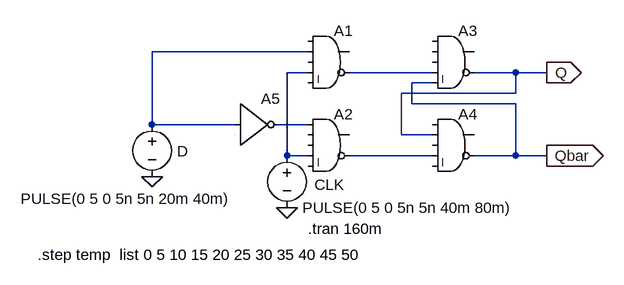
[diagram p0: schematic DFF.asc]
DFF.asc, the LTspice schematic file:
Version 4
SHEET 1 880 680
WIRE 112 80 -128 80
WIRE 112 112 80 112
WIRE 304 112 176 112
WIRE 432 112 368 112
WIRE 480 112 432 112
WIRE 304 128 272 128
WIRE 432 144 432 112
WIRE 432 144 256 144
WIRE 272 160 272 128
WIRE 432 160 272 160
WIRE -128 192 -128 80
WIRE 0 192 -128 192
WIRE 112 192 64 192
WIRE 256 208 256 144
WIRE 304 208 256 208
WIRE 80 240 80 112
WIRE 112 240 80 240
WIRE 304 240 176 240
WIRE 432 240 432 160
WIRE 432 240 368 240
WIRE 480 240 432 240
FLAG -128 272 0
FLAG 80 320 0
FLAG 480 112 Q
IOPIN 480 112 Out
FLAG 480 240 Qbar
IOPIN 480 240 Out
SYMBOL Digital\\and 144 32 R0
SYMATTR InstName A1
SYMBOL Digital\\and 144 160 R0
SYMATTR InstName A2
SYMBOL Digital\\and 336 32 R0
SYMATTR InstName A3
SYMBOL Digital\\and 336 160 R0
SYMATTR InstName A4
SYMBOL Digital\\inv 0 128 R0
SYMATTR InstName A5
SYMBOL voltage -128 176 R0
WINDOW 0 39 57 Left 2
WINDOW 3 -202 130 Left 2
WINDOW 123 0 0 Left 0
SYMATTR InstName D
SYMATTR Value PULSE(0 5 0 5n 5n 20m 40m)
SYMBOL voltage 80 224 R0
WINDOW 0 42 61 Left 2
WINDOW 123 0 0 Left 0
WINDOW 39 0 0 Left 0
SYMATTR InstName CLK
SYMATTR Value PULSE(0 5 0 5n 5n 40m 80m)
TEXT 112 352 Left 2 !.tran 160m
TEXT -304 392 Left 2 !.step temp  list 0 5 10 15 20 25 30 35 40 45 50

The netlist it stands for:
* DFF.asc
A1 0 N001 0 N002 0 N003 0 0 AND
A2 N004 0 0 N002 0 N005 0 0 AND
A3 0 0 0 N003 Qbar Q 0 0 AND
A4 0 Q 0 N005 0 Qbar 0 0 AND
A5 N001 0 0 0 0 N004 0 0 BUF
V§D N001 0 PULSE(0 5 0 5n 5n 20m 40m)
V§CLK N002 0 PULSE(0 5 0 5n 5n 40m 80m)
.tran 160m
.step temp  list 0 5 10 15 20 25 30 35 40 45 50
.backanno
.end

* Results of the author's LTspice run, read from the files saved beside the schematic
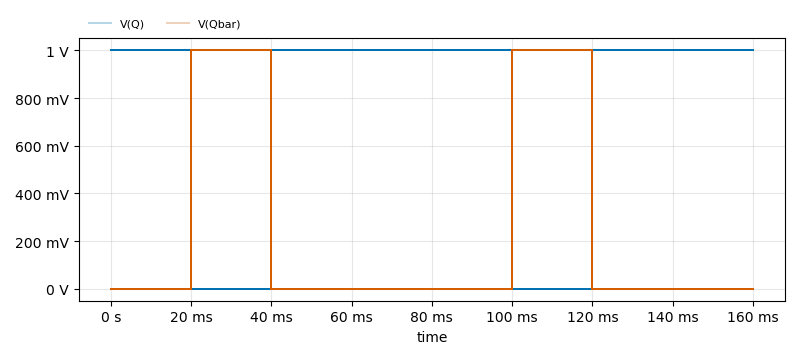
[diagram p1: Transient Analysis of DFF.asc, plotted from the saved traces]
* Transient Analysis, 11 runs:
*   V(Q) [temp=0°C]: min 0 V, max 1 V, average 750 mV, rms 866 mV, last 1 V
*   V(Q) [temp=5°C]: min 0 V, max 1 V, average 750 mV, rms 866 mV, last 1 V
*   V(Q) [temp=10°C]: min 0 V, max 1 V, average 750 mV, rms 866 mV, last 1 V
*   V(Q) [temp=15°C]: min 0 V, max 1 V, average 750 mV, rms 866 mV, last 1 V
*   V(Q) [temp=20°C]: min 0 V, max 1 V, average 750 mV, rms 866 mV, last 1 V
*   V(Q) [temp=25°C]: min 0 V, max 1 V, average 750 mV, rms 866 mV, last 1 V
*   V(Q) [temp=30°C]: min 0 V, max 1 V, average 750 mV, rms 866 mV, last 1 V
*   V(Q) [temp=35°C]: min 0 V, max 1 V, average 750 mV, rms 866 mV, last 1 V
*   V(Qbar) [temp=0°C]: min 0 V, max 1 V, average 250 mV, rms 500 mV, last 0 V
*   V(Qbar) [temp=5°C]: min 0 V, max 1 V, average 250 mV, rms 500 mV, last 0 V
*   V(Qbar) [temp=10°C]: min 0 V, max 1 V, average 250 mV, rms 500 mV, last 0 V
*   V(Qbar) [temp=15°C]: min 0 V, max 1 V, average 250 mV, rms 500 mV, last 0 V
*   V(Qbar) [temp=20°C]: min 0 V, max 1 V, average 250 mV, rms 500 mV, last 0 V
*   V(Qbar) [temp=25°C]: min 0 V, max 1 V, average 250 mV, rms 500 mV, last 0 V
*   V(Qbar) [temp=30°C]: min 0 V, max 1 V, average 250 mV, rms 500 mV, last 0 V
*   V(Qbar) [temp=35°C]: min 0 V, max 1 V, average 250 mV, rms 500 mV, last 0 V